# Altium schematic sheet [13]-Motorcontroller.SchDoc: Motorcontroller
size A3; Organization: Toradex AG; Address1: Altsagenstrasse 5; Address2: Horw; Address3: 6048; Address4: Switzerland; DocumentNumber: 12; Revision: V3.2; SheetNumber: 12; SheetTotal: 13; PageSetup: Record=PageOptions|CenterHorizontal=True|CenterVertical=True|PrintScale=0.73|XCorrection=1.00|YCorrection=1.00|PrintKind=0|BorderSize=5000000|LeftOffset=0|BottomOffset=0|Orientation=2|PaperLength=1000|PaperWidth=1000|Scale=100|PaperSource=7|PrintQuality=-4|MediaType=1|DitherType=10|PaperKind=A4|PrintScaleMode=1
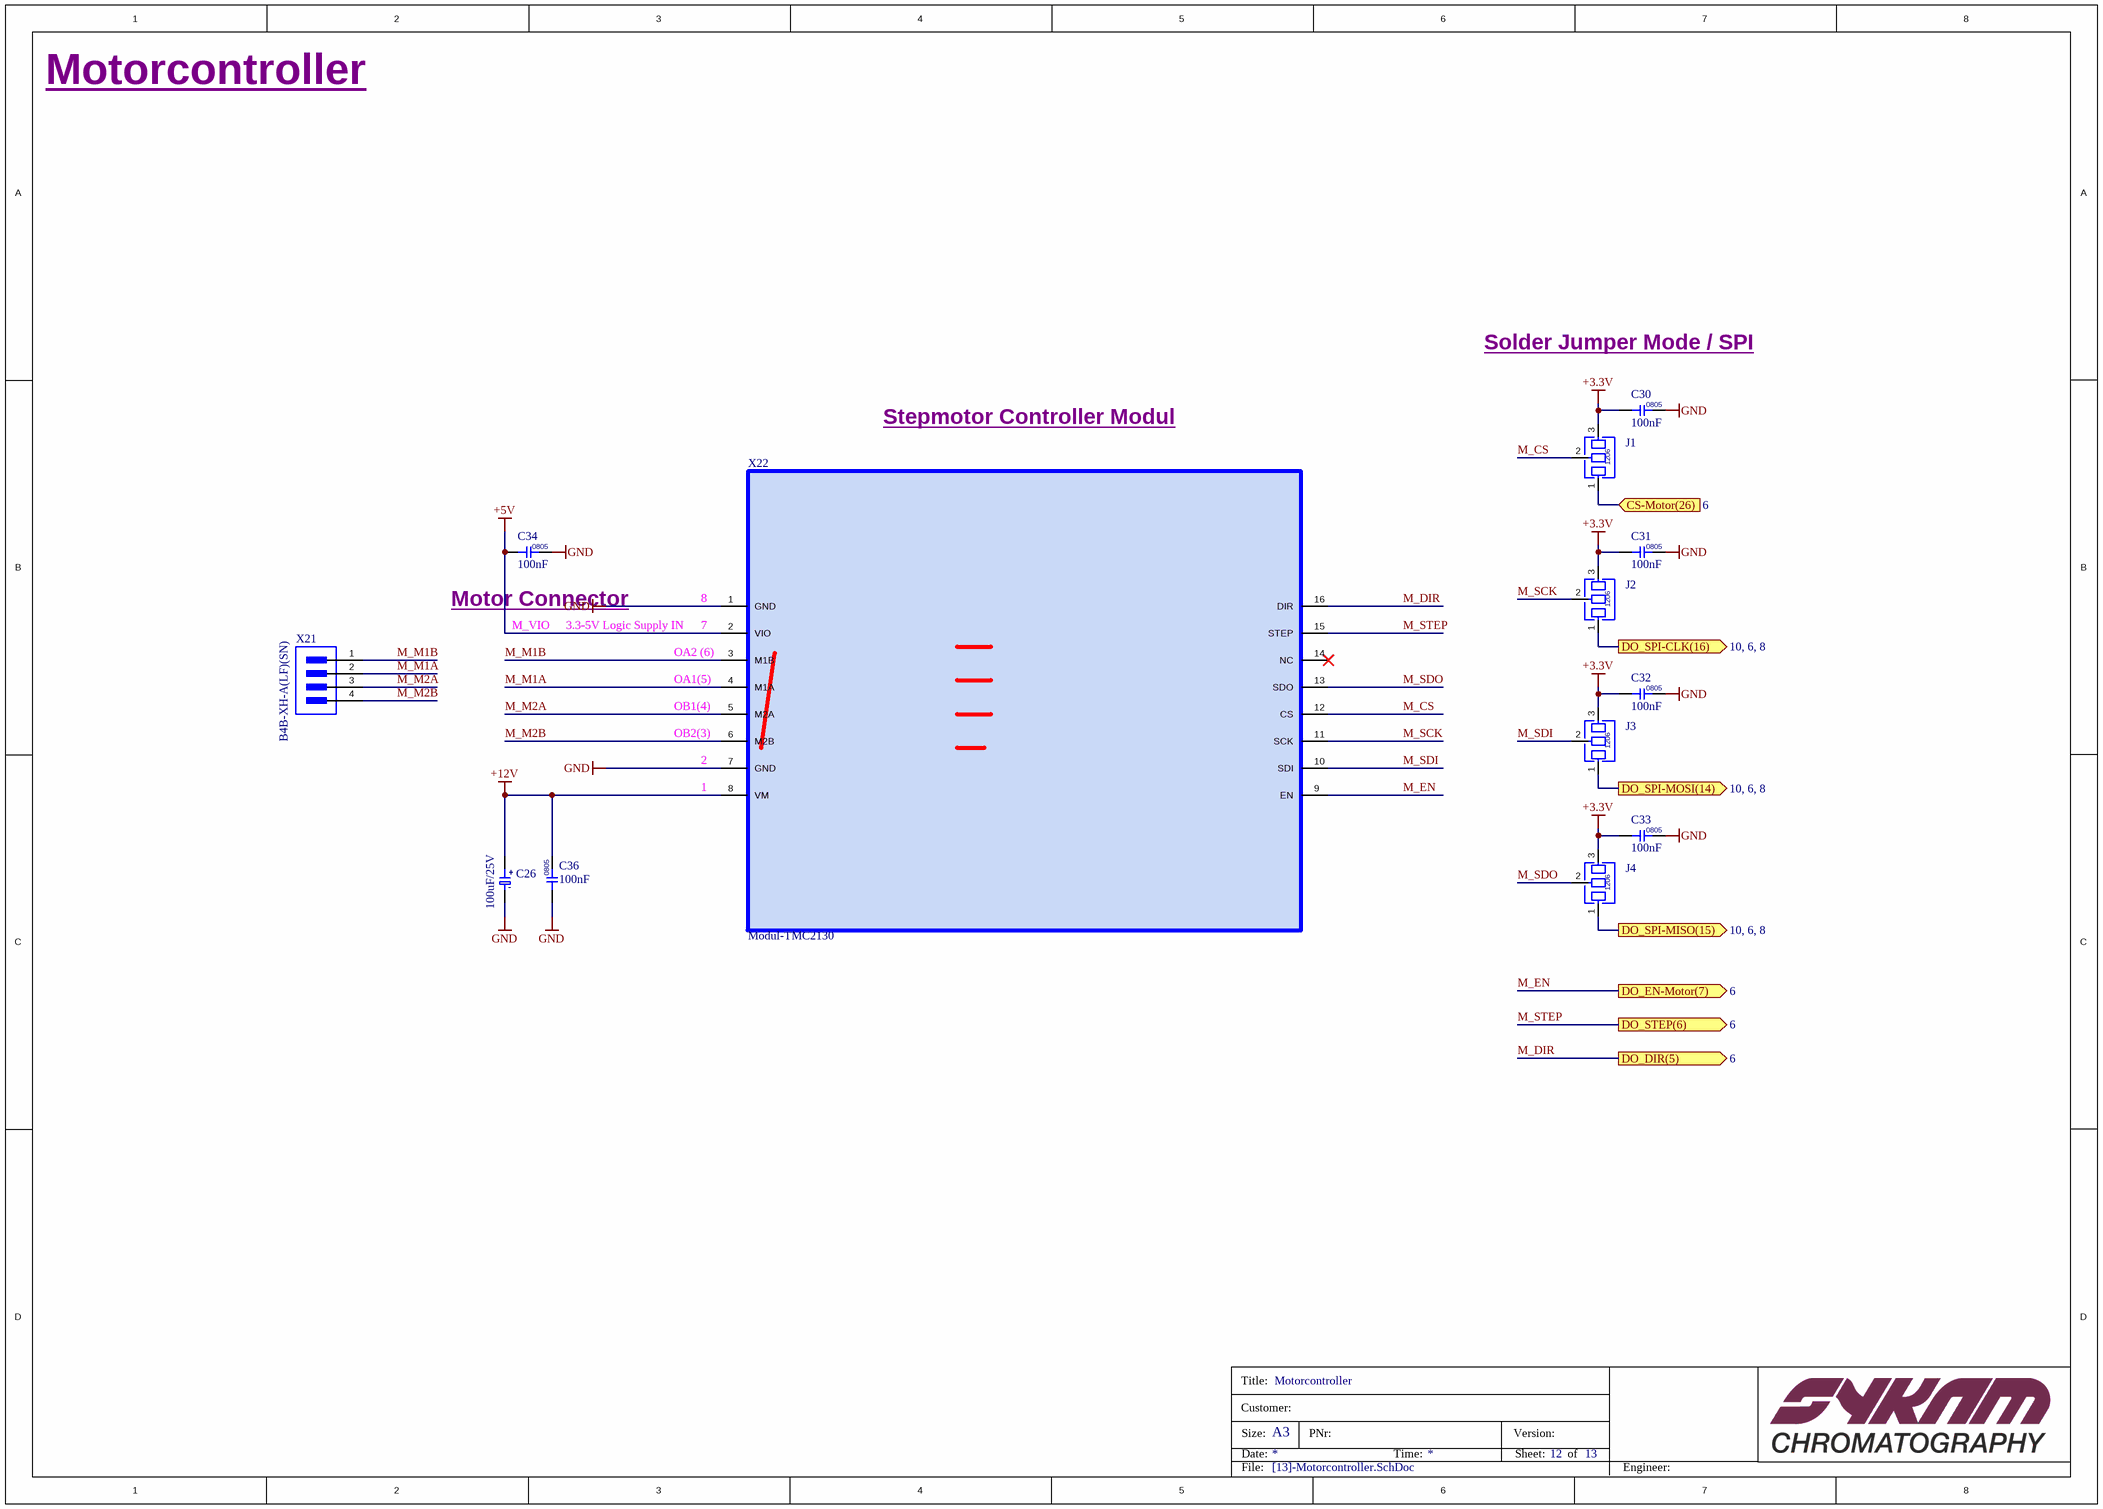
[diagram p0: [13]-Motorcontroller.SchDoc]

## Parts
C26  100uF/25V  [C_A768EB107M1ELAE036-100uF]
C30  100nF  [C0805]
C31  100nF  [C0805]
C32  100nF  [C0805]
C33  100nF  [C0805]
C34  100nF  [C0805]
C36  100nF  [C0805]
J1  SolderJumper-no-Part  [SolderJumper-R1206]  (value not drawn)
J2  SolderJumper-no-Part  [SolderJumper-R1206]  (value not drawn)
J3  SolderJumper-no-Part  [SolderJumper-R1206]  (value not drawn)
J4  SolderJumper-no-Part  [SolderJumper-R1206]  (value not drawn)
X21  B4B-XH-A(LF)(SN)  [CON_B4B-XH-A(LF)(SN)]
X22  Modul-TMC2130  [TMC2130-Connectors]

## Ports
CS-Motor(26) (in, see 6), DO_DIR(5) (out, see 6), DO_EN-Motor(7) (out, see 6), DO_SPI-CLK(16) (out, see 10, 6, 8), DO_SPI-MISO(15) (out, see 10, 6, 8), DO_SPI-MOSI(14) (out, see 10, 6, 8), DO_STEP(6) (out, see 6)

## Nets
+3.3V: C30.1 C31.1 C32.1 C33.1 J1.3 J2.3 J3.3 J4.3
+5V: C34.1 X22.2(VIO)
+12V: C26.1 C36.2 X22.8(VM)
GND: C26.2 C30.2 C31.2 C32.2 C33.2 C34.2 C36.1 X22.1(GND) X22.7(GND)
CS-Motor(26): J1.1 ; port CS-Motor(26)
DO_SPI-CLK(16): J2.1 ; port DO_SPI-CLK(16)
DO_SPI-MISO(15): J4.1 ; port DO_SPI-MISO(15)
DO_SPI-MOSI(14): J3.1 ; port DO_SPI-MOSI(14)
M_CS: J1.2 X22.12(CS)
M_DIR: X22.16(DIR) ; port DO_DIR(5)
M_EN: X22.9(EN) ; port DO_EN-Motor(7)
M_M1A: X21.2 X22.4(M1A)
M_M1B: X21.1 X22.3(M1B)
M_M2A: X21.3 X22.5(M2A)
M_M2B: X21.4 X22.6(M2B)
M_SCK: J2.2 X22.11(SCK)
M_SDI: J3.2 X22.10(SDI)
M_SDO: J4.2 X22.13(SDO)
M_STEP: X22.15(STEP) ; port DO_STEP(6)

Not connected (* = marked no-connect by the designer): X22 14(NC)*

## Notes on the sheet
- Solder Jumper Mode / SPI
- Stepmotor Controller Modul
- (near X21) Motor Connector
- M_VIO
- 3.3-5V Logic Supply IN
- (near X22) 7
- (near X22) 8
- (near X22) OB1(4)
- (near X22) OA1(5)
- (near X22) OA2 (6)
- (near X22) OB2(3)
- (near X22) 2
- (near X22) 1
- Title:
- Customer:
- Size:
- Date:
- A3
- PNr:
- Time:
- Version:
- Sheet:
- of
- File:
- Engineer:
- Title
- Number:
- Revision:
- Sheet
- (in symbol C_100uF/25V_A768EB107M1ELAE036) +; -
- (in symbol J_SolderJumper-no-Part) 1206

## Library data of the parts
C26 = C_100uF/25V_A768EB107M1ELAE036: Cap Alum Poly 100UF 20% 25V SMD; Manufacturer: KEMET; Supplier 1: Farnell; Manufacturer Part Number: A768EB107M1ELAE036; RoHS: Yes; Category: Polymer Capacitors; Pricing 1: 10000=0,15100 (EUR); Supplier Part Number 1: 4071179
C30-C34 C36 = C_100nF_CC0805KRX7R9BB104: CAP CER 0.1UF 50V X7R 0805; Manufacturer: Yageo; Material: Ceramic; Tolerance: 10%; Insulation Resistance: 100GR; PCBChecked: initials after Checked; Supplier 1: Digi-Key; Manufacturer Part Number: CC0805KRX7R9BB104; RoHS: Yes; Category: Ceramic Capacitors; Mount: Surface Mount; Case/Package: 0805; Number of Pins: 2; Case Code (Metric): 2012; Case Code (Imperial): 0805; Min Operating Temperature: -55°C; Max Operating Temperature: 125°C; Packaging: Tape and Reel; Capacitance: 100nF; Voltage Rating: 50V; Package Quantity: 1; Dielectric: X7R; Termination: SMD/SMT; Voltage: 50V; Length: 2mm; Height: 0.85mm; Width: 0.049inch; Thickness: 0.033inch; Depth: 1.25mm; Radiation Hardening: No; REACH SVHC: No SVHC; Lead Free: Lead Free; Halogen Free: Halogen Free; ComponentLink1URL: https://datasheet.ciiva.com/11786/0900766b80d84f1d-11786009.pdf?src-supplier=RSComponents; ComponentLink1Description: https://datasheet.ciiva.com/11786/0900766b80d84f1d-11786009.pdf?src-supplier=RSComponents; ComponentLink2URL: https://datasheet.ciiva.com/11464/upy-gphc-x7r-6-3v-to-50v-8-11464757.pdf?src-supplier=Avnet; ComponentLink2Description: https://datasheet.ciiva.com/11464/upy-gphc-x7r-6-3v-to-50v-8-11464757.pdf?src-supplier=Avnet; ComponentLink3URL: https://datasheet.ciiva.com/28450/1489800-28450805.pdf?src-supplier=Element14; ComponentLink3Description: https://datasheet.ciiva.com/28450/1489800-28450805.pdf?src-supplier=Element14; ComponentLink4URL: https://datasheet.ciiva.com/155/mlccorderingcode-155929.pdf?src-supplier=Digi-Key; ComponentLink4Description: https://datasheet.ciiva.com/155/mlccorderingcode-155929.pdf?src-supplier=Digi-Key; ComponentLink5URL: https://datasheet.ciiva.com/155/mlccorderingcode-155930.pdf?src-supplier=Digi-Key; ComponentLink5Description: https://datasheet.ciiva.com/155/mlccorderingcode-155930.pdf?src-supplier=Digi-Key; ComponentLink6URL: https://datasheet.ciiva.com/155/mlccorderingcode-155931.pdf?src-supplier=Digi-Key; ComponentLink6Description: https://datasheet.ciiva.com/155/mlccorderingcode-155931.pdf?src-supplier=Digi-Key; ComponentLink7URL: https://datasheet.ciiva.com/46393/1734573-46393307.pdf?src-supplier=Element14; ComponentLink7Description: https://datasheet.ciiva.com/46393/1734573-46393307.pdf?src-supplier=Element14; ComponentLink8URL: https://datasheet.ciiva.com/16625/upy-gphc-x7r-6-3v-to-50v-8-16625549.pdf?src-supplier=Avnet+Europe; ComponentLink8Description: https://datasheet.ciiva.com/16625/upy-gphc-x7r-6-3v-to-50v-8-16625549.pdf?src-supplier=Avnet+Europe; ComponentLink9URL: https://datasheet.ciiva.com/29242/445210-da-01-en-kerko-chip-0805-x7r-0-1uf-10proz-50vg-29242074.pdf?src-supplier=Conrad; ComponentLink9Description: https://datasheet.ciiva.com/29242/445210-da-01-en-kerko-chip-0805-x7r-0-1uf-10proz-50vg-29242074.pdf?src-supplier=Conrad; Supplier Part Number 1: 311-1140-6-ND; Stock 1: 7118979; IPC7352C: done; SCHChecked: Initials after checked
J1-J4 = J_SolderJumper-no-Part: SolderJumper-no-Part 1206
X21 = CON_4pol_B4B-XH-A(LF)(SN): JST (JAPAN SOLDERLESS TERMINALS) - B4B-XH-A (LF)(SN) - Wire-To-Board-Steckverbinder, vertikal, 2.5 mm, 4 Kontakt(e), Stiftleiste, Baureihe XH; Connector Type: Male Pin; Number of Positions: 4; Gender: Male; Contact Resistance: 20mR; Current Rating: 3A; Max Voltage Rating (AC): 250V; Insulation Resistance: 1GR; Pitch: 2.5mm; Wire/Cable Gauge: 22AWG; Supplier 1: Newark; Manufacturer: JST; Manufacturer Part Number: B4B-XH-A(LF)(SN); RoHS: Yes; Category: FFC / FPC; Mount: Through Hole; Contact Plating: Tin,Copper,Lead; Contact Material: Brass; Color: Natural; Housing Material: Polyamide; Housing Color: White; Material: Polyamide; Min Operating Temperature: -25°C; Max Operating Temperature: 85°C; Number of Rows: 1; Packaging: Bulk; Termination: Press-Fit; Max Current Rating: 3A; Package Quantity: 500; Orientation: Straight; Voltage Rating (AC): 250V; Voltage Rating: 250V; Max Voltage Rating (DC): 250V; Number of Contacts: 4; Length: 12.4mm; Depth: 5.75mm; Lead Pitch: 2.5mm; Lead Free: Lead Free; REACH SVHC: No SVHC; ComponentLink1URL: https://datasheet.ciiva.com/26894/getdatasheetpartid-455616-26894787.pdf?src-supplier=Verical; ComponentLink1Description: https://datasheet.ciiva.com/26894/getdatasheetpartid-455616-26894787.pdf?src-supplier=Verical; ComponentLink2URL: https://datasheet.ciiva.com/26924/getdatasheetpartid-640571-26924035.pdf?src-supplier=Verical; ComponentLink2Description: https://datasheet.ciiva.com/26924/getdatasheetpartid-640571-26924035.pdf?src-supplier=Verical; ComponentLink3URL: https://datasheet.ciiva.com/16203/b4b-xh-alfsn-16203642.pdf?src-supplier=Future+Electronics; ComponentLink3Description: https://datasheet.ciiva.com/16203/b4b-xh-alfsn-16203642.pdf?src-supplier=Future+Electronics; ComponentLink4URL: https://datasheet.ciiva.com/726/exh-726404.pdf?src-supplier=Digi-Key; ComponentLink4Description: https://datasheet.ciiva.com/726/exh-726404.pdf?src-supplier=Digi-Key; Supplier Part Number 1: 73M9436
X22 = CON_Modul_TMCSILENTSTEPSTICK SPI: TMC2130STEPPERDRIVERBOARD; Manufacturer: Trinamic; Supplier 1: Mouser; Manufacturer Part Number: TMC SILENTSTEPSTICK SPI; RoHS: No; Category: Integrated Circuits (ICs); ComponentLink1URL: http://www.farnell.com/datasheets/2551906.pdf?src-supplier=Farnell; ComponentLink1Description: http://www.farnell.com/datasheets/2551906.pdf?src-supplier=Farnell; ComponentLink2URL: https://www.trinamic.com/fileadmin/assets/Products/ICs_Documents/TMC2130_datasheet.pdf?src-supplier=Digi-Key; ComponentLink2Description: https://www.trinamic.com/fileadmin/assets/Products/ICs_Documents/TMC2130_datasheet.pdf?src-supplier=Digi-Key; Supplier Part Number 1: 700-TMCSILENTSTEPSPI